# Altium project MyPCB_Homework.PrjPcb
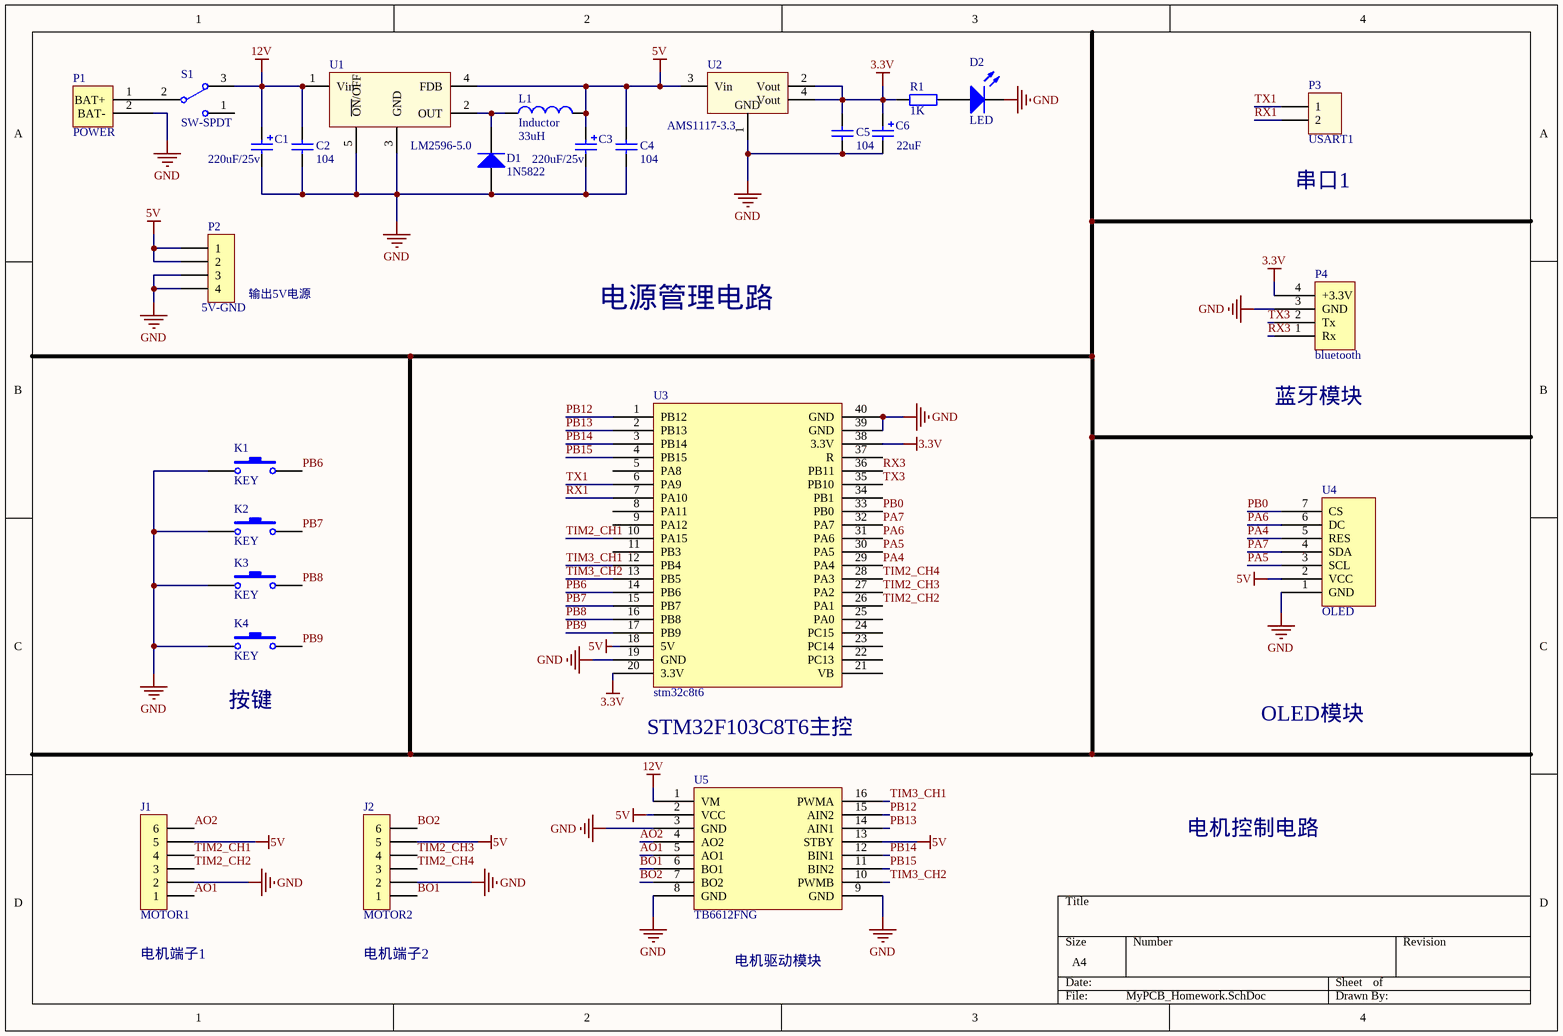
[diagram p0: MyPCB_Homework.SchDoc]
1 sheet, 26 parts. Net scope: global (net labels, ports and power ports of the same name join across sheets).
Board file: MyPCB_Homework.PcbDoc

## Sheet MyPCB_Homework.SchDoc
size A4

### Parts
C1  Cap Pol(22uF)  [CAP POL [25V]]  (value not drawn)
C2  Cap  [0805C]  (value not drawn)
C3  Cap Pol(22uF)  [CAP POL [25V]]  (value not drawn)
C4  Cap  [0805C]  (value not drawn)
C5  Cap  [0805C]  (value not drawn)
C6  Cap Pol(22uF)  [CAP[1210]]  (value not drawn)
D1  1N5822  [0805LED1]
D2  LED  [0805LED1]
J1  MOTOR1  [XH2.54-LI-6P]
J2  MOTOR2  [XH2.54-LI-6P]
K1  KEY  [KEl]
K2  KEY  [KEl]
K3  KEY  [KEl]
K4  KEY  [KEl]
L1  Inductor  [Inductor_T10uH]
P1  POWER  [电源端子]
P2  5V-GND  [4p-接线端子]
P3  USART1  [HDR1X2]
P4  bluetooth  [bluetooth]
R1  1K  [0805R]
S1  SW-SPDT  [SW-TO3]
U1  LM2596-5.0  [TO-263-5]
U2  AMS1117-3.3  [SOT-223]
U3  stm32c8t6  [STM32F103C8T6最小系统1]
U4  OLED  [OLED]
U5  TB6612FNG  [TB6612FNG]

### Nets
3.3V: C5.2 C6.1 P4.4(+3.3V) R1.1 U2.2(Vout) U2.4(Vout) U3.20(3.3V) U3.38(3.3V)
5V: C3.1 C4.2 J1.5 J2.5 L1.2 P2.1 P2.2 U1.4(FDB) U2.3(Vin) U3.18(5V) U4.2(VCC) U5.2(VCC) U5.13(STBY)
12V: C1.1 C2.2 S1.3 U1.1(Vin) U5.1(VM)
GND: C1.2 C2.1 C3.2 C4.1 C5.1 C6.2 D1.1 D2.2(K) J1.2 J2.2 K1.1 K2.1 K3.1 K4.1 P1.2(BAT-) P2.3 P2.4 P4.3(GND) U1.3(GND) U1.5(~{ON}/OFF) U2.1(GND) U3.19(GND) U3.39(GND) U3.40(GND) U4.1(GND) U5.3(GND) U5.8(GND) U5.9(GND)
AO1: J1.1 U5.5(AO1)
AO2: J1.6 U5.4(AO2)
BO1: J2.1 U5.6(BO1)
BO2: J2.6 U5.7(BO2)
PA4: U3.29(PA4) U4.5(RES)
PA5: U3.30(PA5) U4.3(SCL)
PA6: U3.31(PA6) U4.6(DC)
PA7: U3.32(PA7) U4.4(SDA)
PB0: U3.33(PB0) U4.7(CS)
PB6: K1.2 U3.14(PB6)
PB7: K2.2 U3.15(PB7)
PB8: K3.2 U3.16(PB8)
PB9: K4.2 U3.17(PB9)
PB12: U3.1(PB12) U5.15(AIN2)
PB13: U3.2(PB13) U5.14(AIN1)
PB14: U3.3(PB14) U5.12(BIN1)
PB15: U3.4(PB15) U5.11(BIN2)
RX1: P3.2 U3.7(PA10)
RX3: P4.1(Rx) U3.36(PB11)
TIM2_CH1: J1.4 U3.10(PA15)
TIM2_CH2: J1.3 U3.26(PA1)
TIM2_CH3: J2.4 U3.27(PA2)
TIM2_CH4: J2.3 U3.28(PA3)
TIM3_CH1: U3.12(PB4) U5.16(PWMA)
TIM3_CH2: U3.13(PB5) U5.10(PWMB)
TX1: P3.1 U3.6(PA9)
TX3: P4.2(Tx) U3.35(PB10)
NetD1_2: D1.2 L1.1 U1.2(OUT)
NetD2_1: D2.1(A) R1.2
NetP1_1: P1.1(BAT+) S1.2

Not connected (* = marked no-connect by the designer): S1 1; U3 5(PA8) 8(PA11) 9(PA12) 11(PB3) 21(VB) 22(PC13) 23(PC14) 24(PC15) 25(PA0) 34(PB1) 37(R)

### Notes on the sheet
- (near P3) 串口1
- (near P2) 输出5V电源
- 电源管理电路
- (near P4) 蓝牙模块
- (near K4) 按键
- STM32F103C8T6主控
- OLED模块
- 电机控制电路
- (near J1) 电机端子1
- (near J2) 电机端子2
- 电机驱动模块
- (in symbol Cap Pol(22uF)) 220uF/25v; 22uF
- (in symbol Cap_1) 104
- (in symbol Inductor_1) 33uH

### Library data of the parts
C2 C4 C5 = Cap_1
D1 = 1N5819
D2 = LED_BLUE
J1 J2 = XH-2.54-6: Connector
L1 = Inductor_1
P2 = CON4: Connector
P3 = H2X1
R1 = Res2: Resistor; Published: 8-Jun-2000; LatestRevisionDate: 17-Jul-2002; LatestRevisionNote: Re-released for DXP Platform.; PackageReference: AXIAL-0.4; Publisher: Altium Limited; PackageDescription: Axial Device, Thru-Hole; 2 Leads; 0.4 in Pin Spacing
S1 = SW-SPDT: SPDT Subminiature Toggle Switch, Right Angle Mounting, Vertical Actuation; Published: 24-Mar-1999; LatestRevisionDate: 17-Dec-2003; LatestRevisionNote: Schematic revised, PCB Footprint replaced.; DatasheetVersion: 05-Dec-2000; PackageReference: TL36WW15050; Publisher: Altium Limited; PackageDescription: Switch; 4 Leads; ComponentLink1Description: Manufacturer Link; ComponentLink1URL: http://www.apem.com
U1 = LM2596-5.0: IC
U5 = TB6612